# Altium project dcdc_g4.PrjPcb
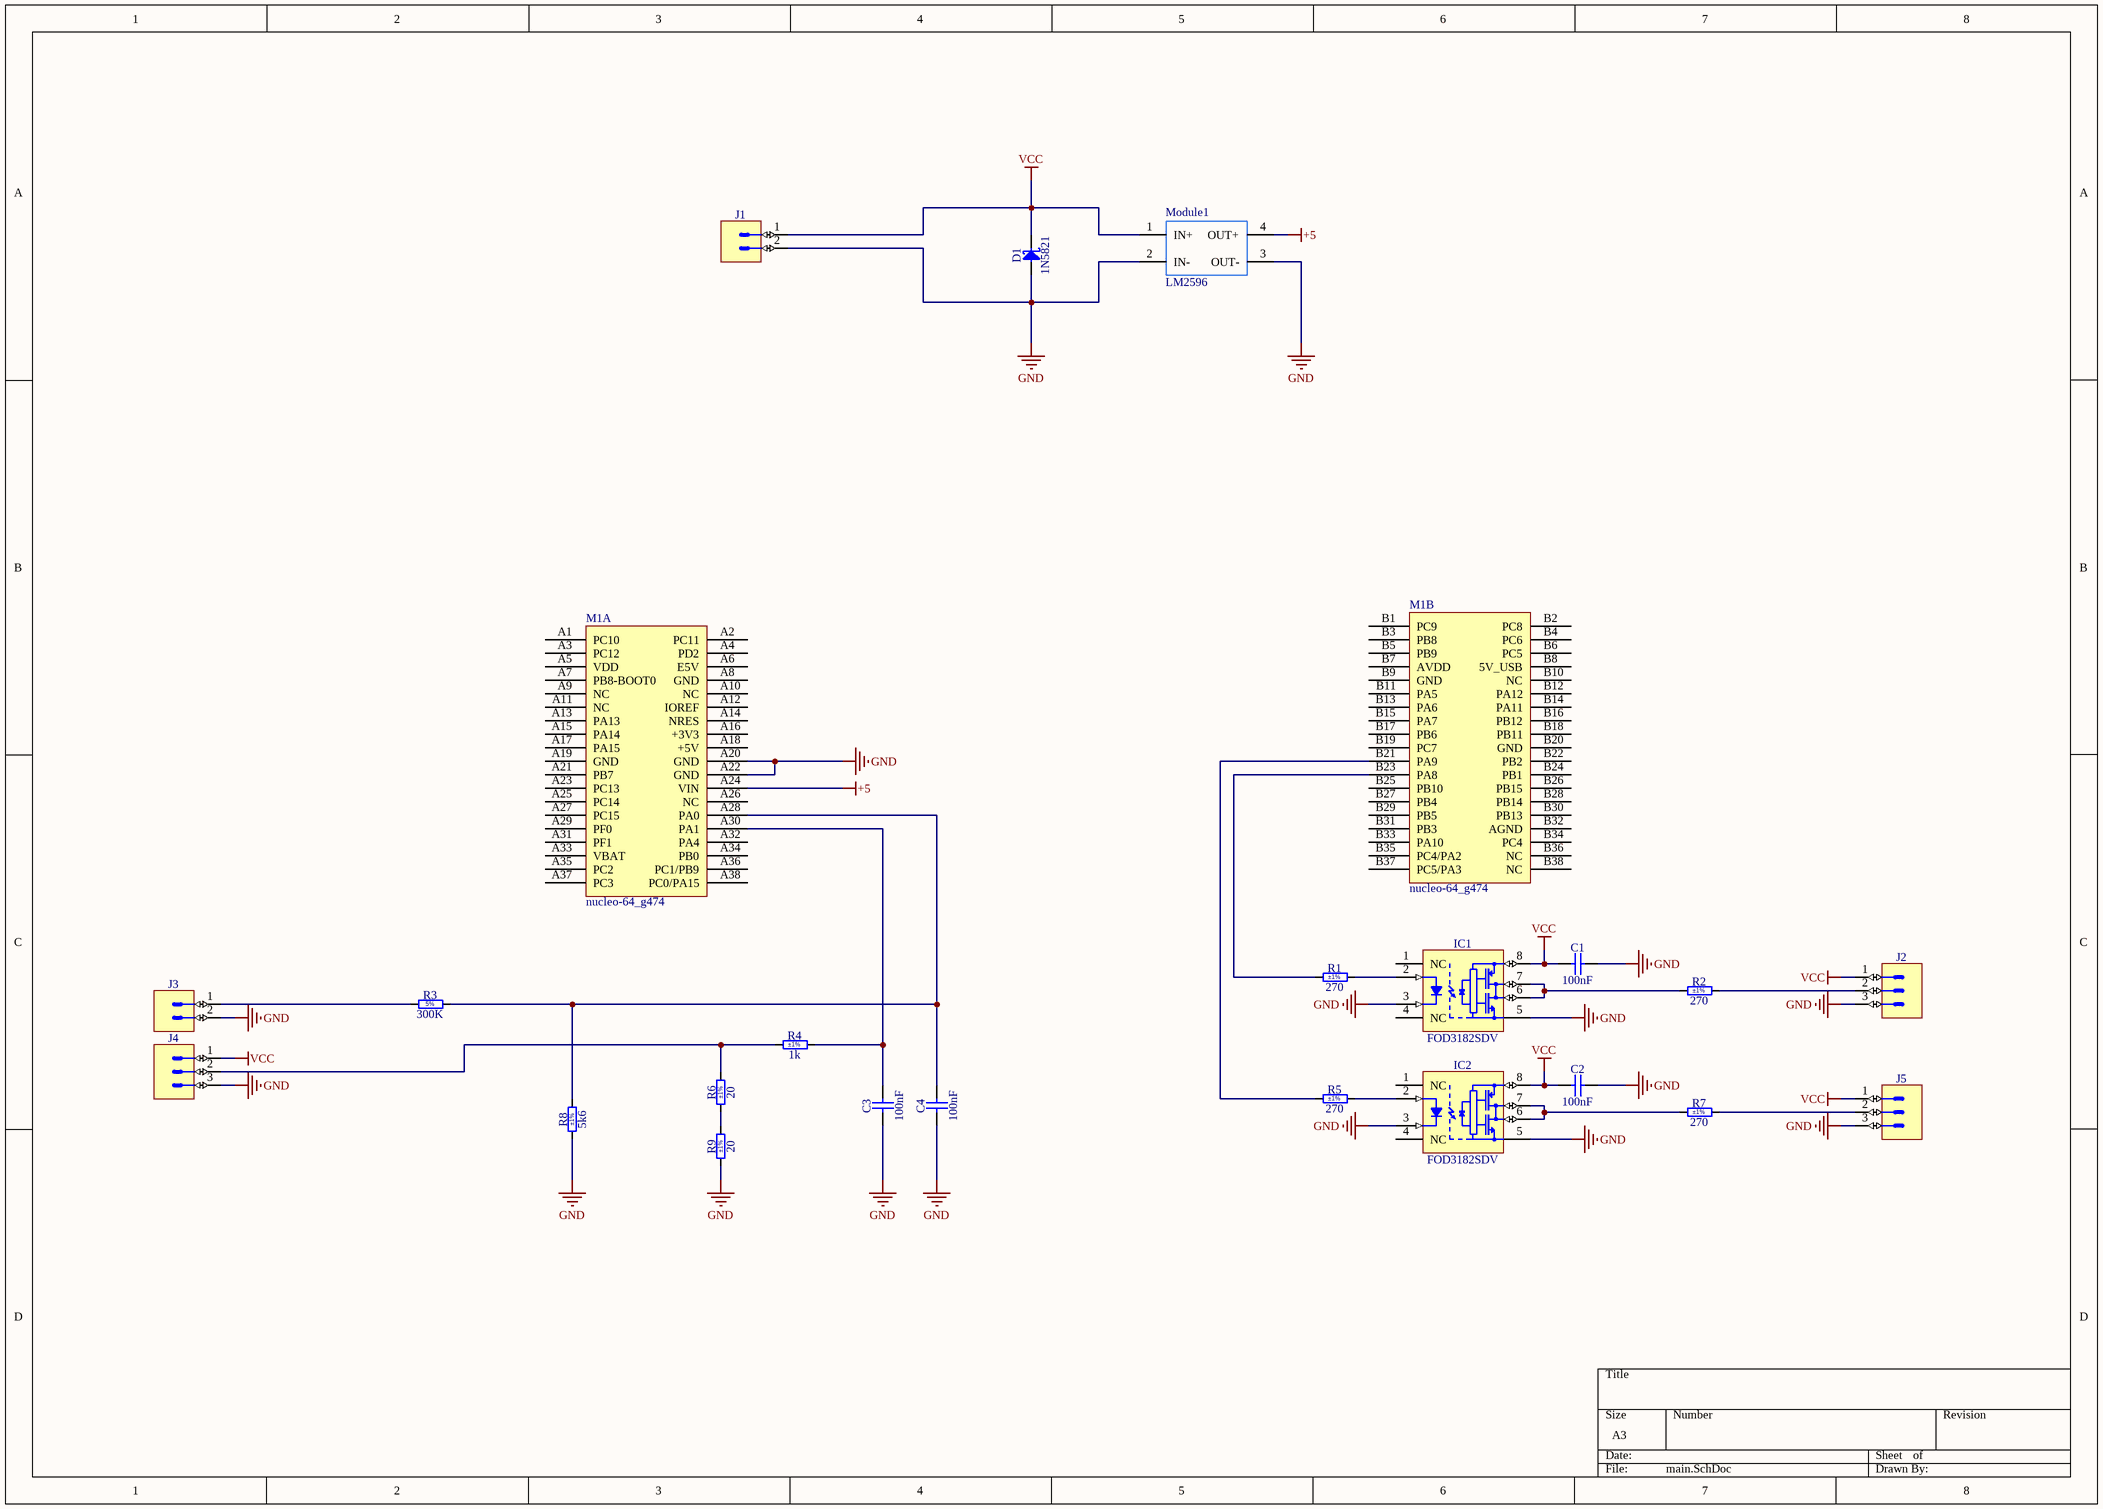
[diagram p0: main.SchDoc]
1 sheet, 23 parts. Net scope: global (net labels, ports and power ports of the same name join across sheets).
Board files: PCB1.PcbDoc, PCB2.PcbDoc

## Sheet main.SchDoc
size A3; SheetNumber: 1; SheetTotal: 1

### Parts
C1  100nF  [CAPRR508-350X500X500]
C2  100nF  [CAPRR508-350X500X500]
C3  100nF  [CAPRR508-350X500X500]
C4  100nF  [CAPRR508-350X500X500]
D1  1N5821  [DO-201AD]
IC1  FOD3182SDV  [FAIRCHILD_8LD MDIP (OPTION S)]
IC2  FOD3182SDV  [FAIRCHILD_8LD MDIP (OPTION S)]
J1  (no value)  [PHOENIX_1757242]
J2  (no value)  [PHOENIX_1757255]
J3  (no value)  [PHOENIX_1757242]
J4  (no value)  [PHOENIX_1757255]
J5  (no value)  [PHOENIX_1757255]
M1  nucleo-64_g474  [nucleo-64_g474]  (parts A,B of 2)
Module1  LM2596  [DCDC]
R1  270  Tolerance: ±1%  [RES1016-630X250]
R2  270  Tolerance: ±1%  [RES1016-630X250]
R3  300K  [RES_PANASONIC_ERG5S]
R4  1k  Tolerance: ±1%  [RES1016-630X250]
R5  270  Tolerance: ±1%  [RES1016-630X250]
R6  20  Tolerance: ±1%  [RES1016-630X250]
R7  270  Tolerance: ±1%  [RES1016-630X250]
R8  5k6  Tolerance: ±1%  [RES1016-630X250]
R9  20  Tolerance: ±1%  [RES1016-630X250]

### Nets
+5: M1.A24(VIN) Module1.4(OUT+)
GND: C1.2 C2.2 C3.1 C4.1 D1.2(A) IC1.3(K) IC1.5(VSS) IC2.3(K) IC2.5(VSS) J1.2 J2.3 J3.2 J4.3 J5.3 M1.A20(GND) M1.A22(GND) Module1.2(IN-) Module1.3(OUT-) R8.1 R9.1
VCC: C1.1 C2.1 D1.1(C) IC1.8(VDD) IC2.8(VDD) J1.1 J2.1 J4.1 J5.1 Module1.1(IN+)
NetC3_2: C3.2 M1.A30(PA1) R4.2
NetC4_2: C4.2 M1.A28(PA0) R3.2 R8.2
NetIC1_2: IC1.2(A) R1.2
NetIC1_6: IC1.6(VO1) IC1.7(VO2) R2.1
NetIC2_2: IC2.2(A) R5.2
NetIC2_6: IC2.6(VO1) IC2.7(VO2) R7.1
NetJ2_2: J2.2 R2.2
NetJ3_1: J3.1 R3.1
NetJ4_2: J4.2 R4.1 R6.2
NetJ5_2: J5.2 R7.2
NetM1_B21: M1.B21(PA9) R5.1
NetM1_B23: M1.B23(PA8) R1.1
NetR6_1: R6.1 R9.2

Not connected (* = marked no-connect by the designer): IC1 1(NC) 4(NC); IC2 1(NC) 4(NC); M1 A1(PC10) A2(PC11) A3(PC12) A4(PD2) A5(VDD) A6(E5V) A7(PB8-BOOT0) A8(GND) A9(NC) A10(NC) A11(NC) A12(IOREF) A13(PA13) A14(NRES) A15(PA14) A16(+3V3) A17(PA15) A18(+5V) A19(GND) A21(PB7) A23(PC13) A25(PC14) A26(NC) A27(PC15) A29(PF0) A31(PF1) A32(PA4) A33(VBAT) A34(PB0) A35(PC2) A36(PC1/PB9) A37(PC3) A38(PC0/PA15) B1(PC9) B2(PC8) B3(PB8) B4(PC6) B5(PB9) B6(PC5) B7(AVDD) B8(5V_USB) B9(GND) B10(NC) B11(PA5) B12(PA12) B13(PA6) B14(PA11) B15(PA7) B16(PB12) B17(PB6) B18(PB11) B19(PC7) B20(GND) B22(PB2) B24(PB1) B25(PB10) B26(PB15) B27(PB4) B28(PB14) B29(PB5) B30(PB13) B31(PB3) B32(AGND) B33(PA10) B34(PC4) B35(PC4/PA2) B36(NC) B37(PC5/PA3) B38(NC)

### Notes on the sheet
- (in symbol RMF_100K_5%_5W_200PPM_PANASONIC_ERG5SJ104) 5%

### Library data of the parts
C1-C4 = CCR_100NF_50V_10%_X7R_508-350X500X500: Non-polarised capacitor; Part Description: Radial Lead Type Monolithic Ceramic Capacitor; Manufacturer: MURATA; Manufacturer Part Number: RPER71H104K2M1A03A; Status Comment: Can be replaced by KEMET C322C104K5R5TA; Voltage: 50VDC; TC: X7R; Tolerance: ±10%; Part Number: CCR_100NF_50V_10%_X7R_508-350X500X500; Component Kind: Standard; Component Type: Standard; Pin Count: 2; Value: 100nF; Status: Obsolete; Case: LS5.08 W3.5 x L5 x H5; Mounted: Yes; Socket: No; SMD: No; Sense: No; ComponentHeight: 5.0mm; HelpURL: \\cern.ch\dfs\Applications\Altium\Datasheets\CCR_MURATA_RPE.pdf; Author: CERN DEM JLC; CreateDate: 28.01.2008; LatestRevisionDate: 03.08.2016
D1 = 1N5821: Schottky Diode; Part Description: Schottky Rectifier; Manufacturer: FAIRCHILD SEMICONDUCTOR; Voltage: 30V; Power: 3A; PressFit: No; Bonding: No; Part Number: 1N5821; Component Kind: Standard; Component Type: Standard; Device: 1N5821; PackageDescription: DO-201AD, Diode, Axial; Lead Spacing 20.32mm, Lead Dia. 1.3mm, Body Length 9.5mm, Body Dia. 5.6mm; Manufacturer Part Number: 1N5821; Pin Count: 2; Case: DO-201AD; Mounted: Yes; Socket: No; SMD: No; Sense: No; ComponentHeight: 5.6mm; HelpURL: \\cern.ch\dfs\Applications\Altium\Datasheets\1N5821.pdf; Author: CERN DEM JLC; CreateDate: 05.03.2012; LatestRevisionDate: 05.03.2012
IC1 IC2 = FOD3182SDV: Optocoupler; Part Description: 3A Output Current, High Speed MOSFET Gate Driver Optocoupler; Manufacturer: FAIRCHILD SEMICONDUCTOR; PressFit: No; Bonding: No; Part Number: FOD3182SDV; Component Kind: Standard; Component Type: Standard; Device: FOD3182SDV; PackageDescription: DIP Gull Wing Surface Mount, 2.54mm Pitch; 8 Pin, 9.65mm W X 6.60mm L X 5.08mm H body, FAIRCHILD 8LD MDIP; Manufacturer Part Number: FOD3182SDV; Pin Count: 8; Case: DIP8 SMD; Mounted: Yes; Socket: No; SMD: Yes; Sense: No; ComponentHeight: 5.08mm; HelpURL: \\cern.ch\dfs\Applications\Altium\Datasheets\FOD3182SDV.pdf; Author: CERN DEM JLC; CreateDate: 20.10.2014; LatestRevisionDate: 20.10.2014
J1 J3 = PHOENIX_1757242: Connector 2 Male; Part Description: 12A, 250V, Pitch 5.08mm, 2 Positions Header; Manufacturer: PHOENIX CONTACT; Manufacturer Part Number: 1757242 (MSTBA 2,5/ 2-G-5,08); PressFit: No; Part Number: PHOENIX_1757242; Component Kind: Standard; Component Type: Standard; Pin Count: 2; Mounted: Yes; Socket: No; SMD: No; Sense: No; Status: None; ComponentHeight: 8.6mm; HelpURL: \\cern.ch\dfs\Applications\Altium\Datasheets\PHOENIX_1757242.pdf; Author: CERN DEM JLC; CreateDate: 21.09.2016; LatestRevisionDate: 21.09.2016
J2 J4 J5 = PHOENIX_1757255: Connector 3 Male; Part Description: 12A, 250V, Pitch 5.08mm, 3 Positions Header; Manufacturer: PHOENIX CONTACT; Manufacturer Part Number: 1757255 (MSTBA 2,5/ 3-G-5,08); PressFit: No; Part Number: PHOENIX_1757255; Component Kind: Standard; Component Type: Standard; Pin Count: 3; Mounted: Yes; Socket: No; SMD: No; Sense: No; Status: None; ComponentHeight: 8.6mm; HelpURL: \\cern.ch\dfs\Applications\Altium\Datasheets\PHOENIX_1757255.pdf; Author: CERN DEM JLC; CreateDate: 10.02.2010; LatestRevisionDate: 26.04.2010
R1 R2 R5 R7 = RMF_270R_1%_0.6W_50PPM_1016-630X250: Resistor - 1%; Part Description: Leaded Metal Film Resistor; Manufacturer: GENERIC; Manufacturer1 Part Number: MBB02070C2700FCT00; Power: 0.6W; TC: ±50ppm/°C; PressFit: No; Part Number: RMF_270R_1%_0.6W_50PPM_1016-630X250; Component Kind: Standard; Component Type: Standard; Pin Count: 2; Value: 270; Status: Preferred; Manufacturer Part Number: RMF_270R_1%_0.6W_50PPM_1016-630X250; Case: LS10.16 L6.3 x D2.5; Mounted: Yes; Sense: No; Socket: No; SMD: No; ComponentHeight: 2.5mm; Manufacturer1 Example: VISHAY BEYSCHLAG; Manufacturer1 ComponentHeight: 2.5mm; HelpURL: \\cern.ch\dfs\Applications\Altium\Datasheets\RMF_VISHAY_MBB0207.pdf; Author: CERN DEM JLC; CreateDate: 04.12.2007; LatestRevisionDate: 07.04.2008
R3 = RMF_100K_5%_5W_200PPM_PANASONIC_ERG5SJ104: Resistor - 5%; Part Description: Metal Oxide Film Resistor (ERG5S Series); Value: 100k; Power: 5W; TC: ±200ppm/°C; PressFit: No; Part Number: RMF_100K_5%_5W_200PPM_PANASONIC_ERG5SJ104; Component Kind: Standard; Component Type: Standard; Pin Count: 2; Status: Not recommended; Tolerance: ±5%; Manufacturer: PANASONIC; Manufacturer Part Number: ERG5SJ104; Case: LS30 L24 x D8; Mounted: Yes; Sense: No; Socket: No; SMD: No; ComponentHeight: 8.1mm; HelpURL: \\cern.ch\dfs\Applications\Altium\Datasheets\RMF_PANASONIC_ERG5S.pdf; Author: CERN DEM BC; CreateDate: 15.04.2020; LatestRevisionDate: 15.04.2020
R4 = RMF_1K_1%_0.6W_50PPM_1016-630X250: Resistor - 1%; Part Description: Leaded Metal Film Resistor; Manufacturer: GENERIC; Manufacturer1 Part Number: MBB02070C1001FCT00; Power: 0.6W; TC: ±50ppm/°C; PressFit: No; Part Number: RMF_1K_1%_0.6W_50PPM_1016-630X250; Component Kind: Standard; Component Type: Standard; Pin Count: 2; Value: 1k; Status: Preferred; Manufacturer Part Number: RMF_1K_1%_0.6W_50PPM_1016-630X250; Case: LS10.16 L6.3 x D2.5; Mounted: Yes; Sense: No; Socket: No; SMD: No; ComponentHeight: 2.5mm; Manufacturer1 Example: VISHAY BEYSCHLAG; Manufacturer1 ComponentHeight: 2.5mm; HelpURL: \\cern.ch\dfs\Applications\Altium\Datasheets\RMF_VISHAY_MBB0207.pdf; Author: CERN DEM JLC; CreateDate: 04.12.2007; LatestRevisionDate: 07.04.2008
R6 R9 = RMF_120R_1%_0.6W_50PPM_1016-630X250: Resistor - 1%; Part Description: Leaded Metal Film Resistor; Manufacturer: GENERIC; Manufacturer1 Part Number: MBB02070C1200FCT00; Value: 120; Power: 0.6W; TC: ±50ppm/°C; PressFit: No; Part Number: RMF_120R_1%_0.6W_50PPM_1016-630X250; Component Kind: Standard; Component Type: Standard; Pin Count: 2; Status: Preferred; Manufacturer Part Number: RMF_120R_1%_0.6W_50PPM_1016-630X250; Case: LS10.16 L6.3 x D2.5; Mounted: Yes; Sense: No; Socket: No; SMD: No; ComponentHeight: 2.5mm; Manufacturer1 Example: VISHAY BEYSCHLAG; Manufacturer1 ComponentHeight: 2.5mm; HelpURL: \\cern.ch\dfs\Applications\Altium\Datasheets\RMF_VISHAY_MBB0207.pdf; Author: CERN DEM JLC; CreateDate: 04.12.2007; LatestRevisionDate: 07.04.2008
R8 = RMF_5K6_1%_0.6W_50PPM_1016-630X250: Resistor - 1%; Part Description: Leaded Metal Film Resistor; Manufacturer: GENERIC; Manufacturer1 Part Number: MBB02070C5601FCT00; Power: 0.6W; TC: ±50ppm/°C; PressFit: No; Part Number: RMF_5K6_1%_0.6W_50PPM_1016-630X250; Component Kind: Standard; Component Type: Standard; Pin Count: 2; Value: 5k6; Status: Preferred; Manufacturer Part Number: RMF_5K6_1%_0.6W_50PPM_1016-630X250; Case: LS10.16 L6.3 x D2.5; Mounted: Yes; Sense: No; Socket: No; SMD: No; ComponentHeight: 2.5mm; Manufacturer1 Example: VISHAY BEYSCHLAG; Manufacturer1 ComponentHeight: 2.5mm; HelpURL: \\cern.ch\dfs\Applications\Altium\Datasheets\RMF_VISHAY_MBB0207.pdf; Author: CERN DEM JLC; CreateDate: 04.12.2007; LatestRevisionDate: 07.04.2008